# EAGLE design Traction_Control_SMD (EAGLE 9.1.3)
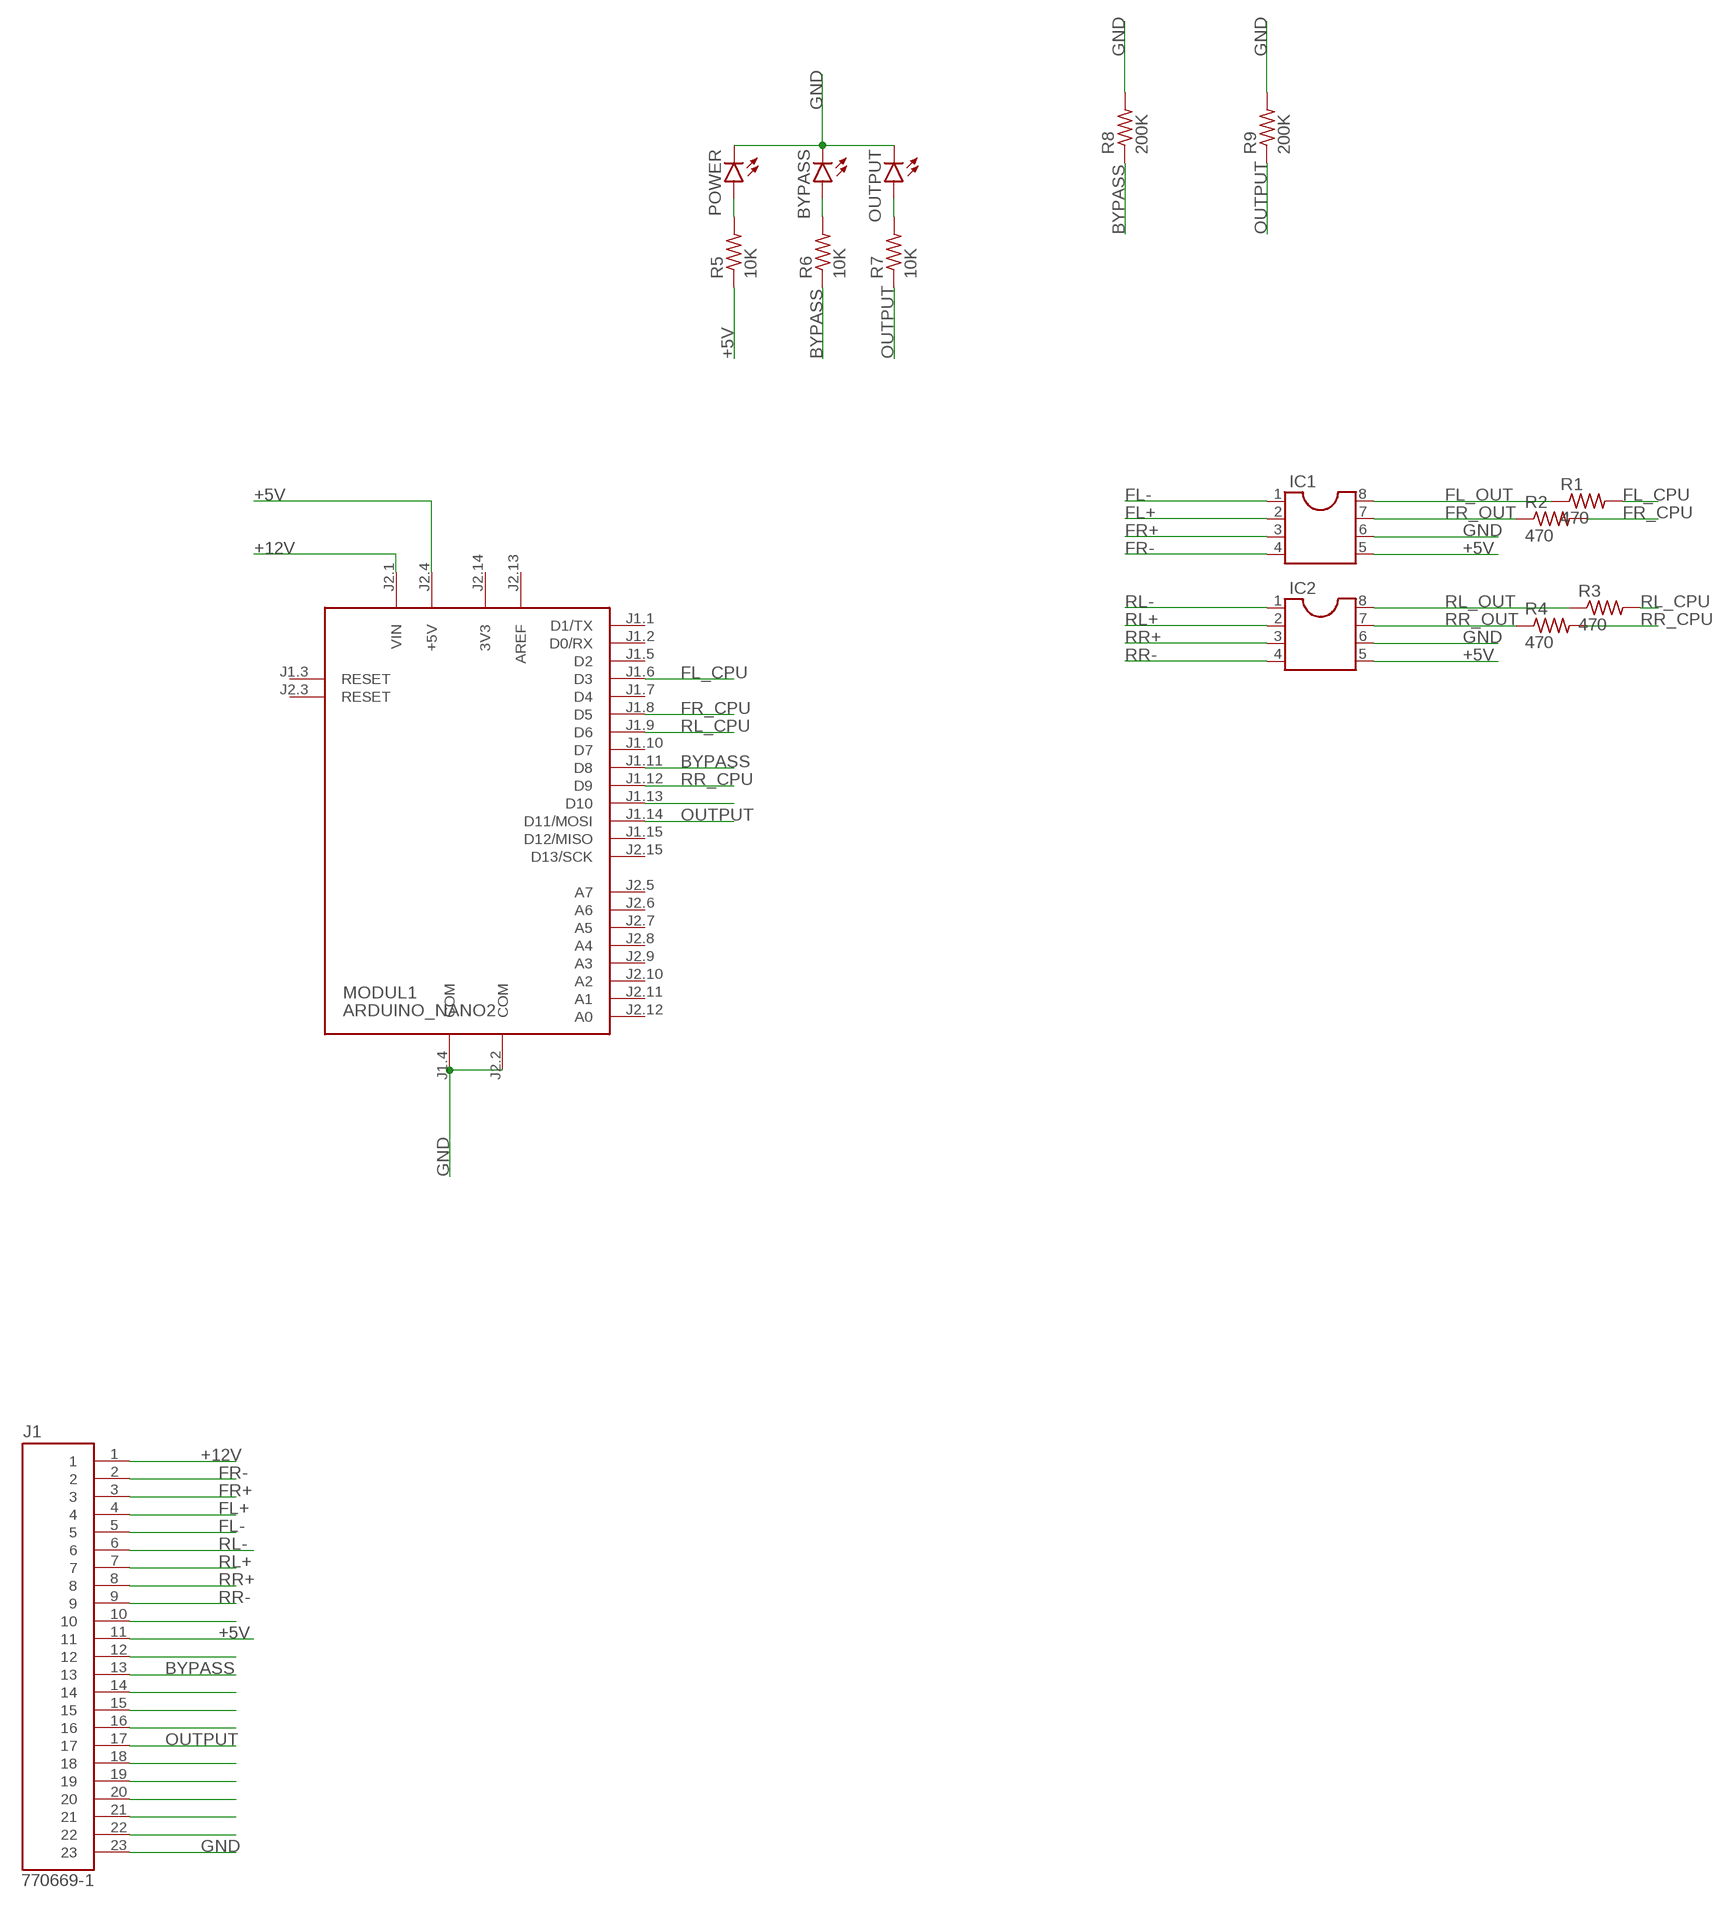
[diagram p0: schematic, sheet 1]

## Parts
BYPASS  LEDCHIP-LED0805  [CHIP-LED0805]
IC1  DIL8S  [SOCKET-08]
IC2  DIL8S  [SOCKET-08]
J1  770669-1  [TE_770669-1]
MODUL1  ARDUINO_NANO2  [ARDUINO_NANO2]
OUTPUT  LEDCHIP-LED0805  [CHIP-LED0805]
POWER  LEDCHIP-LED0805  [CHIP-LED0805]
R1  470  R-US_R0805  [R0805]
R2  470  R-US_R0805  [R0805]
R3  470  R-US_R0805  [R0805]
R4  470  R-US_R0805  [R0805]
R5  10K  R-US_R0805  [R0805]
R6  10K  R-US_R0805  [R0805]
R7  10K  R-US_R0805  [R0805]
R8  200K  R-US_R0805  [R0805]
R9  200K  R-US_R0805  [R0805]

## Nets
+5V: IC1.5 IC2.5 J1.11 MODUL1.J2.4(+5V) R5.1
+12V: J1.1 MODUL1.J2.1(VIN)
BYPASS: J1.13 MODUL1.J1.11(D8) R6.1 R8.1
FL+: IC1.2 J1.4
FL-: IC1.1 J1.5
FL_CPU: MODUL1.J1.6(D3) R1.2
FL_OUT: IC1.8 R1.1
FR+: IC1.3 J1.3
FR-: IC1.4 J1.2
FR_CPU: MODUL1.J1.8(D5) R2.2
FR_OUT: IC1.7 R2.1
GND: BYPASS.C IC1.6 IC2.6 J1.23 MODUL1.J1.4(COM) MODUL1.J2.2(COM) OUTPUT.C POWER.C R8.2 R9.2
N$1: POWER.A R5.2
N$2: BYPASS.A R6.2
N$3: OUTPUT.A R7.2
N$5: MODUL1.J1.13(D10)
N$16: J1.10
N$17: J1.12
N$19: J1.14
N$20: J1.15
N$21: J1.16
N$23: J1.18
N$24: J1.19
N$25: J1.20
N$26: J1.21
N$27: J1.22
OUTPUT: J1.17 MODUL1.J1.14(D11/MOSI) R7.1 R9.1
RL+: IC2.2 J1.7
RL-: IC2.1 J1.6
RL_CPU: MODUL1.J1.9(D6) R3.2
RL_OUT: IC2.8 R3.1
RR+: IC2.3 J1.8
RR-: IC2.4 J1.9
RR_CPU: MODUL1.J1.12(D9) R4.2
RR_OUT: IC2.7 R4.1
Unconnected: MODUL1.J1.1(D1/TX) MODUL1.J1.2(D0/RX) MODUL1.J1.3(RESET) MODUL1.J1.5(D2) MODUL1.J1.7(D4) MODUL1.J1.10(D7) MODUL1.J1.15(D12/MISO) MODUL1.J2.3(RESET) MODUL1.J2.5(A7) MODUL1.J2.6(A6) MODUL1.J2.7(A5) MODUL1.J2.8(A4) MODUL1.J2.9(A3) MODUL1.J2.10(A2) MODUL1.J2.11(A1) MODUL1.J2.12(A0) MODUL1.J2.15(D13/SCK)

## Power pins joined to a net without a drawn wire
3V3: MODUL1.J2.14(3V3)
AREF: MODUL1.J2.13(AREF)

## Library data of the parts
BYPASS OUTPUT POWER = led:LED: LED OSRAM: - CHIPLED LG R971, LG N971, LY N971, LG Q971, LY Q971, LO R971, LY R971 LH N974, LH R974 LS Q976, LO Q976, LY Q976 LO Q996 - Hyper CHIPLED LW Q18S LB Q993, LB Q99A, LB R99A - SideLED LS A670, LO A670, LY A670, LG A670, LP A670 LB A673, LV A673, LT A673, LW A673 LH A674 LY A675 LS A676, LA A676, LO A676, LY A676, LW A676 LS A679, LY A679, LG A679 - Hyper Micro SIDELED® LS Y876, LA Y876, LO Y876, LY Y876 LT Y87S - SmartLED LW L88C, LW L88S LB L89C, LB L89S, LG L890 LS L89K, LO L89K, LY L89K LS L896, LA L896, LO L896, LY L896 - TOPLED LS T670, LO T670, LY T670, LG T670, LP T670 LSG T670, LSP T670, LSY T670, LOP T670, LYG T670 LG T671, LOG T671, LSG T671 LB T673, LV T673, LT T673, LW T673 LH T674 LS T676, LA T676, LO T676, LY T676, LB T676, LH T676, LSB T676, LW T676 LB T67C, LV T67C, LT T67C, LS T67K, LO T67K, LY T67K, LW E67C LS E67B, LA E67B, LO E67B, LY E67B, LB E67C, LV E67C, LT E67C LW T67C LS T679, LY T679, LG T679 LS T770, LO T770, LY T770, LG T770, LP T770 LB T773, LV T773, LT T773, LW T773 LH T774 LS E675, LA E675, LY E675, LS T675 LS T776, LA T776, LO T776, LY T776, LB T776 LHGB T686 LT T68C, LB T68C - Hyper Mini TOPLED® LB M676 - Mini TOPLED Santana® LG M470 LS M47K, LO M47K, LY M47K Source: http://www.osram.convergy.de LUXEON: - LUMILED® LXK2-PW12-R00, LXK2-PW12-S00, LXK2-PW14-U00, LXK2-PW14-V00 LXK2-PM12-R00, LXK2-PM12-S00, LXK2-PM14-U00 LXK2-PE12-Q00, LXK2-PE12-R00, LXK2-PE12-S00, LXK2-PE14-T00, LXK2-PE14-U00 LXK2-PB12-K00, LXK2-PB12-L00, LXK2-PB12-M00, LXK2-PB14-N00, LXK2-PB14-P00, LXK2-PB14-Q00 LXK2-PR12-L00, LXK2-PR12-M00, LXK2-PR14-Q00, LXK2-PR14-R00 LXK2-PD12-Q00, LXK2-PD12-R00, LXK2-PD12-S00 LXK2-PH12-R00, LXK2-PH12-S00 LXK2-PL12-P00, LXK2-PL12-Q00, LXK2-PL12-R00 Source: www.luxeon.com KINGBRIGHT: KA-3528ASYC Source: www.kingbright.com
IC1 IC2 = ic-package:DIL8: Dual In Line / Socket
J1 = 770669-1:770669-1: CONN HEADER 23POS R/A TIN BLK; AVAILABILITY: Unavailable; COMMENT: 770669-1; DESCRIPTION: AMPSEAL 23 Position Three Row Right Angle Snap Mount Pin Header; EU_ROHS_COMPLIANCE: Compliant; MF: TE Connectivity; MP: 770669-1; PACKAGE: None; PRICE: None; TE_PURCHASE_URL: https://www.te.com/usa-en/product-770669-1.html?te_bu=Cor&te_type=disp&te_campaign=seda_glo_cor-seda-global-disp-prtnr-fy19-seda-model-bom-cta_sma-317_1&elqCampaignId=32493
MODUL1 = arduino:ARDUINO_NANO2: Arduino Nano2 Auto generated by modulcreator.ulp \;; ANZAHL: 2; MODUL: TRUE; STECKX0: -76200; STECKX1: 76200; STECKY0: 177800; STECKY1: 177800
R1-R4 = resistor:R-US_: RESISTOR, American symbol
R5-R9 = rcl:R-US_: RESISTOR, American symbol; SPICEPREFIX: R

## Board
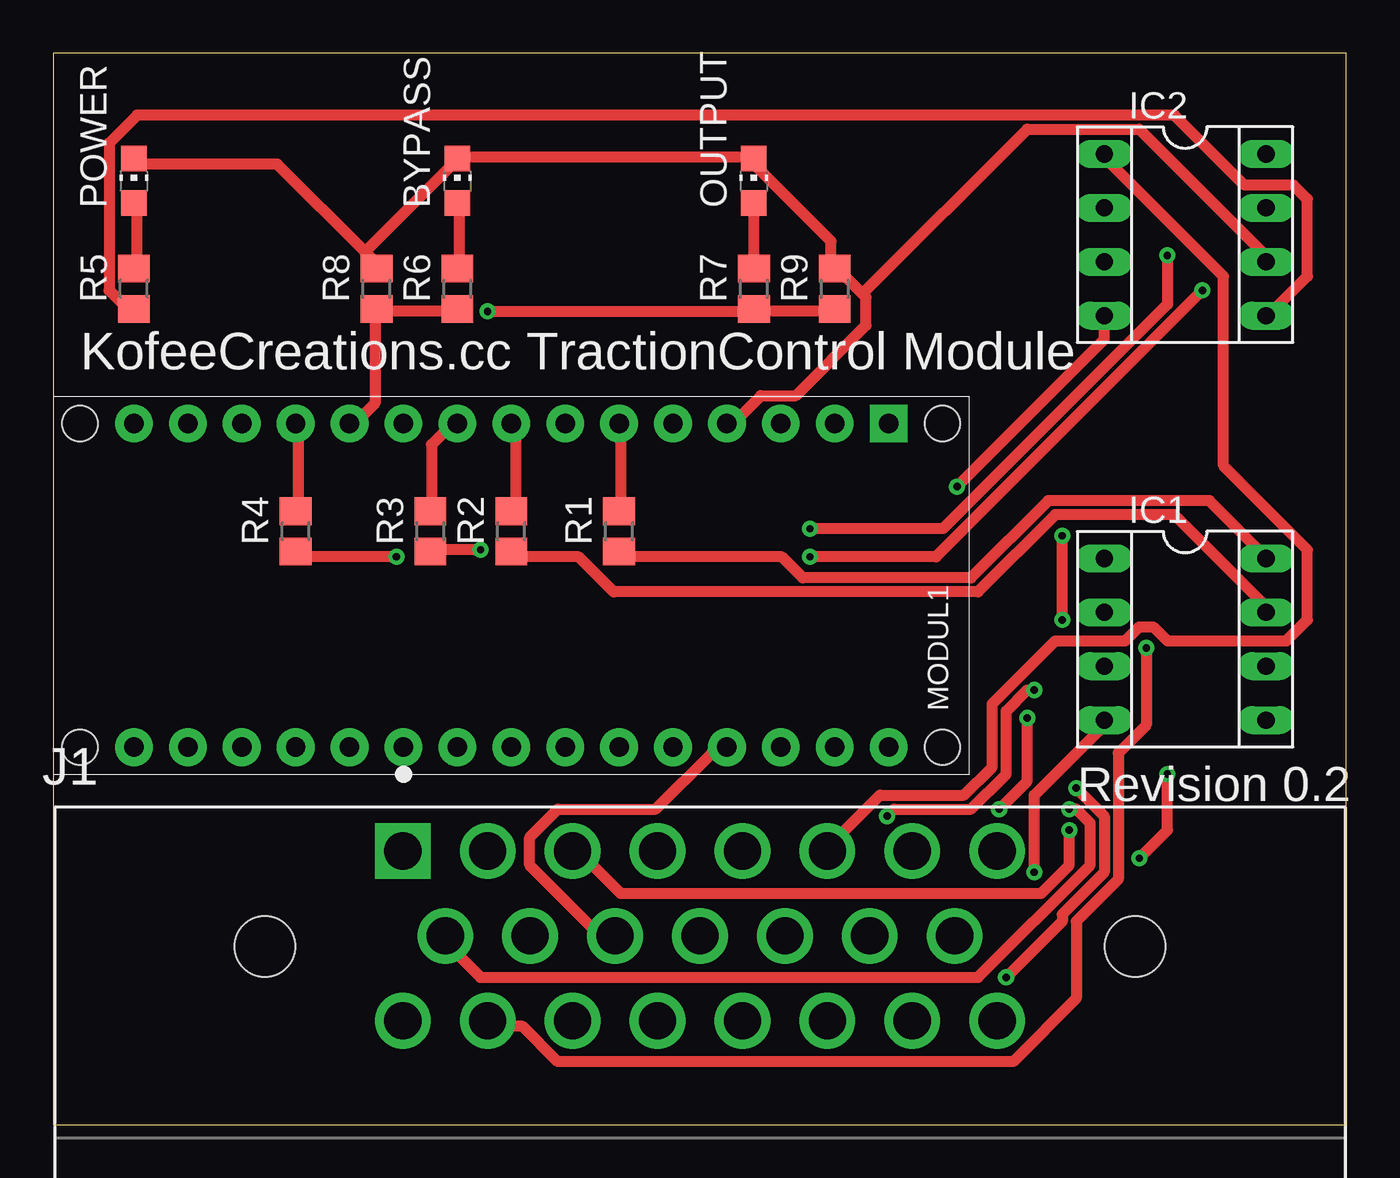
[diagram p1: board, top side]
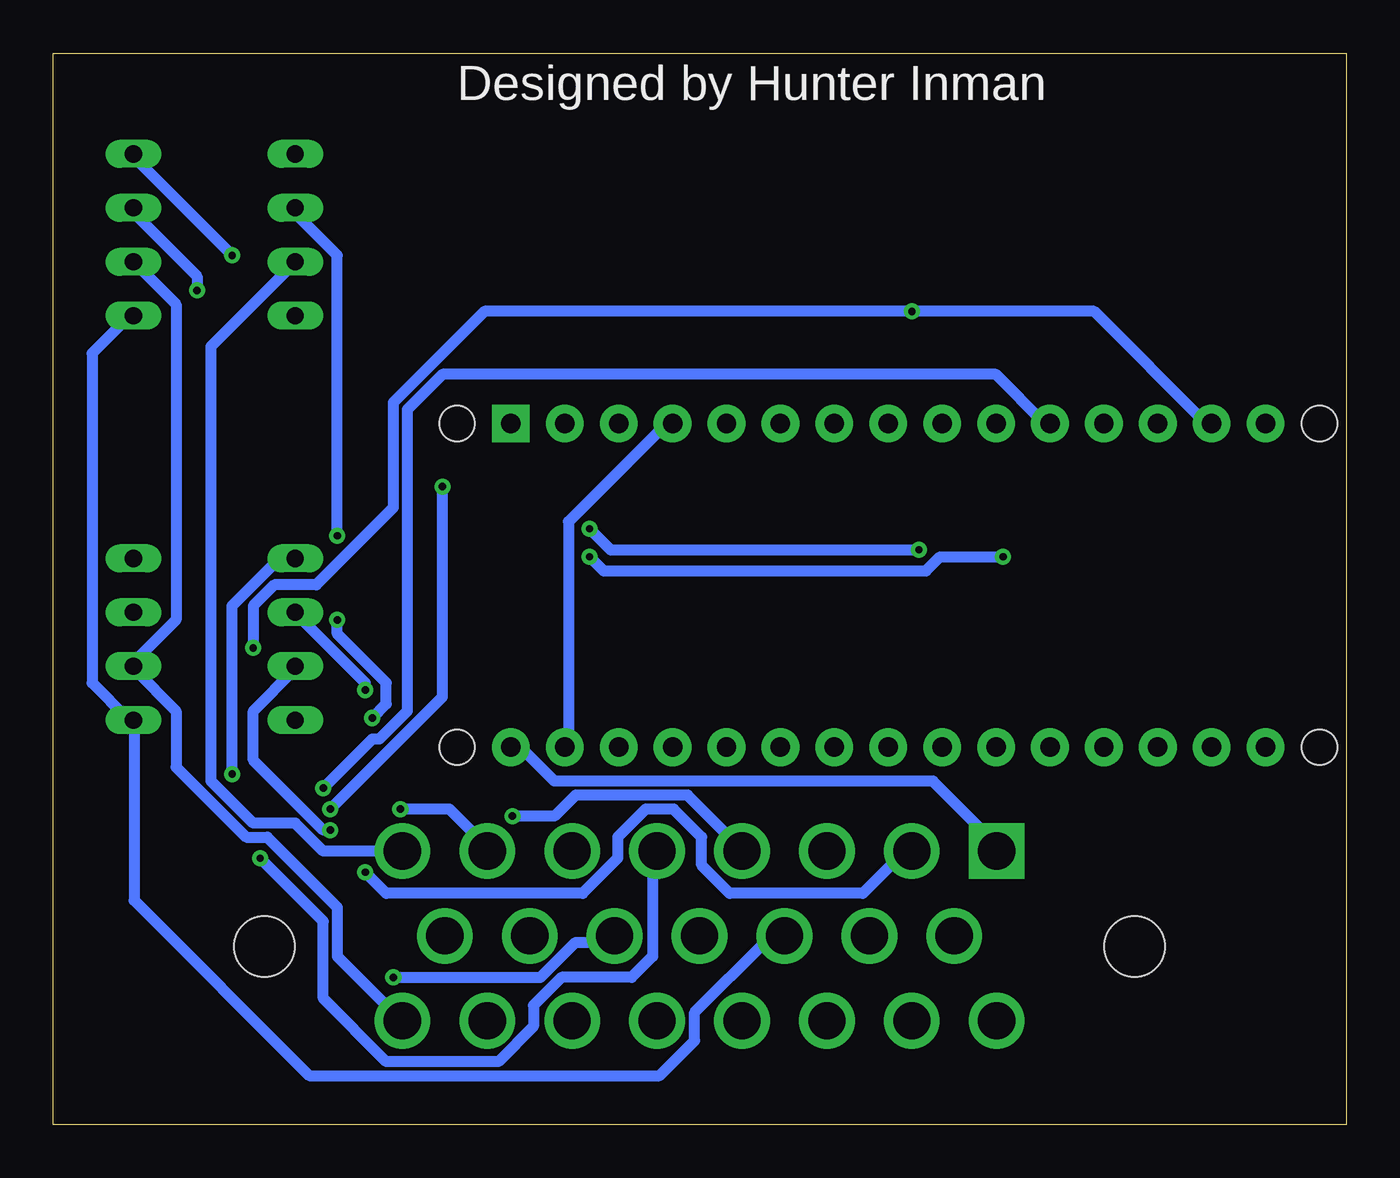
[diagram p2: board, bottom side, seen from below]

Size 60.94 x 50.47 mm. Coordinates in mm from the lower left corner, seen from the top.
Outline: 0,0 60.94,0 60.94,50.47 0,50.47 0,0
Copper layers (1*16): Top 0.035mm / dielectric 1.5mm / Bottom 0.035mm
Design rules "default *": minimum track width 20mil, minimum drill 0.35mm, track to track 6mil, track to pad 6mil, pad to pad 6mil, via to via 6mil, smd to smd 6mil, copper to edge 40mil, drill to drill 6mil, minimum pad ring 10mil, minimum via ring 8mil, stop-mask expansion 4mil, vias tented up to drill 0mil, thermal gap 10mil

### Footprints (pad centres in the part's own frame; a part is rotated, then mirrored left to right if it is on the bottom)
CHIP-LED0805 = smd 1.2 x 1.2: A 0,-1.05; C 0,1.05
SOCKET-08 = drill 0.813 long: 1 -3.81,-3.81; 2 -1.27,-3.81; 3 1.27,-3.81; 4 3.81,-3.81; 5 3.81,3.81; 6 1.27,3.81; 7 -1.27,3.81; 8 -3.81,3.81
TE_770669-1 = drill 1.75 square: 1 -14,4 | drill 1.75: 2 -10,4; 3 -6,4; 4 -2,4; 5 2,4; 6 6,4; 7 10,4; 8 14,4; 9 -12,0; 10 -8,0; 11 -4,0; 12 0,0; 13 4,0; 14 8,0; 15 12,0; 16 -14,-4; 17 -10,-4; 18 -6,-4; 19 -2,-4; 20 2,-4; 21 6,-4; 22 10,-4; 23 14,-4 | hole 2.85: -20.5,-0.5; 20.5,-0.5
ARDUINO_NANO2 = drill 0.914 pad 1.778 square: J1.1 -7.62,17.78 | drill 0.914 pad 1.778: J1.2 -7.62,15.24; J1.3 -7.62,12.7; J1.4 -7.62,10.16; J1.5 -7.62,7.62; J1.6 -7.62,5.08; J1.7 -7.62,2.54; J1.8 -7.62,0; J1.9 -7.62,-2.54; J1.10 -7.62,-5.08; J1.11 -7.62,-7.62; J1.12 -7.62,-10.16; J1.13 -7.62,-12.7; J1.14 -7.62,-15.24; J1.15 -7.62,-17.78; J2.1 7.62,17.78; J2.2 7.62,15.24; J2.3 7.62,12.7; J2.4 7.62,10.16; J2.5 7.62,7.62; J2.6 7.62,5.08; J2.7 7.62,2.54; J2.8 7.62,0; J2.9 7.62,-2.54; J2.10 7.62,-5.08; J2.11 7.62,-7.62; J2.12 7.62,-10.16; J2.13 7.62,-12.7; J2.14 7.62,-15.24; J2.15 7.62,-17.78 | hole 1.651: -7.62,-20.32; 7.62,-20.32; 7.62,20.32; -7.62,20.32
R0805 = smd 1.3 x 1.5: 1 -0.95,0; 2 0.95,0

### Placement (x,y rotation side)
BYPASS  19.05,44.45 0 top
IC1  53.34,22.86 270 top
IC2  53.34,41.91 270 top
J1  30.48,8.89 0 top
MODUL1  21.59,25.4 270 top
OUTPUT  33.02,44.45 0 top
POWER  3.81,44.45 0 top
R1  26.67,27.94 90 top
R2  21.59,27.94 90 top
R3  17.78,27.94 90 top
R4  11.43,27.94 90 top
R5  3.81,39.37 90 top
R6  19.05,39.37 90 top
R7  33.02,39.37 90 top
R8  15.24,39.37 90 top
R9  36.83,39.37 90 top

### Tracks (layer width: path | path; a pad name or v marks a point on that pad's centre or on a via)
+5V
  Top 0.508: MODUL1.J2.4 31.7,17.5 31.04,17.5 28.4,14.86 23.77,14.86 22.45,13.54 22.45,12.22 25.76,8.91 26.42,8.91 J1.11 | R5.1 3.63,38.63 3.3,38.63 2.64,39.29 2.64,46.23 3.96,47.55 52.83,47.55 56.13,44.25 58.45,44.25 59.11,43.59 59.11,39.95 57.45,38.3 IC2.5
  Bottom 0.508: IC2.5 57.45,37.97 59.11,36.32 59.11,20.8 57.45,19.15 IC1.5 57.12,18.82 57.12,10.57 48.87,2.31 32.36,2.31 30.71,3.96 30.71,5.28 27.41,8.59 26.75,8.59 J1.11
+12V
  Bottom 0.508: MODUL1.J2.1 39.29,17.5 38.63,17.5 37.31,16.18 19.48,16.18 16.51,13.21 J1.1
BYPASS  (via drill 0.35)
  Top 0.508: R6.1 18.82,38.3 15.52,38.3 R8.1 15.19,38.3 15.19,34.01 14.2,33.02 MODUL1.J1.11 | v44.91,6.93 47.55,9.58 47.55,9.91 49.53,11.89 49.53,14.53 v48.21,15.85
  Bottom 0.508: v44.91,6.93 37.97,6.93 36.32,8.59 34.67,8.59 J1.13 | v48.21,15.85 45.9,18.16 45.57,18.16 44.25,19.48 44.25,33.68 42.6,35.33 16.51,35.33 14.2,33.02 MODUL1.J1.11
FL+  (via drill 0.35)
  Top 0.508: v46.23,20.47 45.9,20.47 44.91,19.48 44.91,16.51 43.26,14.86 39.62,14.86 v39.29,14.53
  Bottom 0.508: v46.23,20.47 46.23,20.8 49.53,24.11 IC1.2 | v39.29,14.53 37.31,14.53 36.32,15.52 31.04,15.52 28.73,13.21 J1.4
FL-  (via drill 0.35)
  Top 0.508: v52.5,16.51 52.5,13.87 v51.18,12.55
  Bottom 0.508: v52.5,16.51 52.5,24.43 50.52,26.42 49.53,26.42 IC1.1 | v51.18,12.55 48.21,9.58 48.21,5.94 45.24,2.97 39.95,2.97 38.3,4.62 38.3,5.61 36.98,6.93 33.68,6.93 32.69,7.92 32.69,12.88 J1.5
FL_CPU
  Top 0.508: R1.2 26.75,29.06 26.75,33.02 MODUL1.J1.6
FL_OUT
  Top 0.508: R1.1 26.75,26.75 34.34,26.75 35.33,25.76 43.26,25.76 46.89,29.39 54.48,29.39 57.12,26.75 IC1.8
FR+  (via drill 0.35)
  Top 0.508: v47.88,13.87 47.88,12.22 46.56,10.9 26.75,10.9 24.77,12.88 J1.3
  Bottom 0.508: v47.88,13.87 48.21,13.87 51.51,17.17 51.51,19.48 49.53,21.46 IC1.3
FR-  (via drill 0.35)
  Top 0.508: v46.23,11.89 46.23,15.52 49.53,18.82 IC1.4
  Bottom 0.508: v46.23,11.89 45.24,10.9 35.99,10.9 34.34,12.55 34.34,13.54 33.02,14.86 31.7,14.86 30.38,13.54 30.38,12.22 29.06,10.9 22.78,10.9 20.8,12.88 J1.2
FR_CPU
  Top 0.508: R2.2 21.79,29.06 21.79,33.02 MODUL1.J1.8
FR_OUT
  Top 0.508: R2.1 21.79,26.75 24.77,26.75 26.42,25.09 43.59,25.09 47.22,28.73 52.83,28.73 57.12,24.43 IC1.7
GND
  Top 0.508: 14.69,41.11 15.19,40.62 R8.2 | 14.69,41.11 10.57,45.24 3.96,45.24 POWER.C | 14.69,41.11 18.82,45.24 BYPASS.C 19.15,45.57 33.02,45.57 OUTPUT.C 33.02,45.24 36.65,41.6 36.65,40.62 R9.2 36.98,40.28 38.14,39.13 | 38.14,39.13 38.3,38.96 38.3,37.64 35,34.34 33.35,34.34 32.03,33.02 MODUL1.J1.4 | 38.14,39.13 45.9,46.89 51.18,46.89 57.12,40.95 IC2.6
  Bottom 0.508: IC2.6 55.14,38.63 55.14,23.77 57.12,21.79 IC1.6 57.12,21.46 55.14,19.48 55.14,16.84 51.84,13.54 50.85,13.54 47.55,10.24 47.55,7.92 44.58,4.95 J1.23 | MODUL1.J2.2 36.65,17.83 36.65,28.4 32.03,33.02 MODUL1.J1.4
N$1
  Top 0.508: POWER.A 3.96,43.26 3.96,40.62 R5.2
N$2
  Top 0.508: BYPASS.A 19.15,43.26 19.15,40.62 R6.2
N$3
  Top 0.508: R7.2 OUTPUT.A
OUTPUT  (via drill 0.35)
  Top 0.508: 33.02,38.3 36.65,38.3 R9.1 | v20.47,38.3 33.02,38.3 | 33.02,38.3 R7.1 | v51.51,22.45 51.51,18.82 50.19,17.5 50.19,11.56 48.21,9.58 48.21,5.94 45.24,2.97 23.77,2.97 22.12,4.62 20.8,4.62 J1.17
  Bottom 0.508: MODUL1.J1.14 6.6,33.02 11.89,38.3 v20.47,38.3 40.62,38.3 44.91,34.01 44.91,29.06 48.54,25.43 50.52,25.43 51.51,24.43 v51.51,22.45
RL+  (via drill 0.35)
  Top 0.508: v47.55,23.77 v47.55,27.74 | v45.9,19.15 45.9,16.18 v44.58,14.86
  Bottom 0.508: v47.55,27.74 47.55,40.95 49.53,42.93 IC2.2 | v47.55,23.77 47.55,23.11 45.24,20.8 45.24,19.81 v45.9,19.15 | v44.58,14.86 42.27,14.86 40.62,13.21 J1.7
RL-
  Top 0.508: IC2.1 49.53,45.57 55.14,39.95 55.14,31.04 59.11,27.08 59.11,23.77 58.12,22.78 52.5,22.78 51.84,23.44 51.18,23.44 50.52,22.78 47.22,22.78 44.25,19.81 44.25,16.84 42.93,15.52 38.96,15.52 36.65,13.21 J1.6
RL_CPU
  Top 0.508: R3.2 17.83,29.06 17.83,32.03 18.82,33.02 MODUL1.J1.9
RL_OUT  (via drill 0.35)
  Top 0.508: v20.14,27.08 17.83,27.08 R3.1 | v35.66,28.07 41.94,28.07 52.5,38.63 v52.5,40.95
  Bottom 0.508: v20.14,27.08 34.67,27.08 v35.66,28.07 | v52.5,40.95 57.12,45.57 IC2.8
RR+
  Bottom 0.508: IC2.3 49.53,40.62 53.49,36.65 53.49,16.18 51.51,14.2 49.53,14.2 48.21,12.88 44.58,12.88 J1.8
RR-  (via drill 0.35)
  Top 0.508: IC2.4 49.53,36.98 v42.6,30.05 | v47.88,14.86 48.21,14.86 48.87,14.2 48.87,12.22 43.59,6.93 20.14,6.93 18.49,8.59 J1.9
  Bottom 0.508: v42.6,30.05 42.6,20.14 v47.88,14.86
RR_CPU
  Top 0.508: R4.2 11.56,29.06 11.56,33.02 MODUL1.J1.12
RR_OUT  (via drill 0.35)
  Top 0.508: v16.18,26.75 11.56,26.75 R4.1 | v35.66,26.75 41.6,26.75 v54.15,39.29
  Bottom 0.508: v16.18,26.75 19.15,26.75 19.81,26.09 35,26.09 v35.66,26.75 | v54.15,39.29 54.15,39.95 57.12,42.93 IC2.7

### Text on the board
tNames: KofeeCreations.cc TractionControl Module | Revision 0.2
bNames: Designed by Hunter Inman